# EasyEDA Pro project STM32F103C8T6_C6T6核心板.eprj, schematic Schematic3
Board Name: Board3; Create Date: 2025-06-21; Page Name: P3_MicroUSB; Project Name: F103C8T6TYPEC; Schematic Name: Schematic3; Update Date: 2025-06-21; Add into BOM: yes; Company: 嘉立创EDA; Convert to PCB: yes; Page Size: A4; Version: V1.0
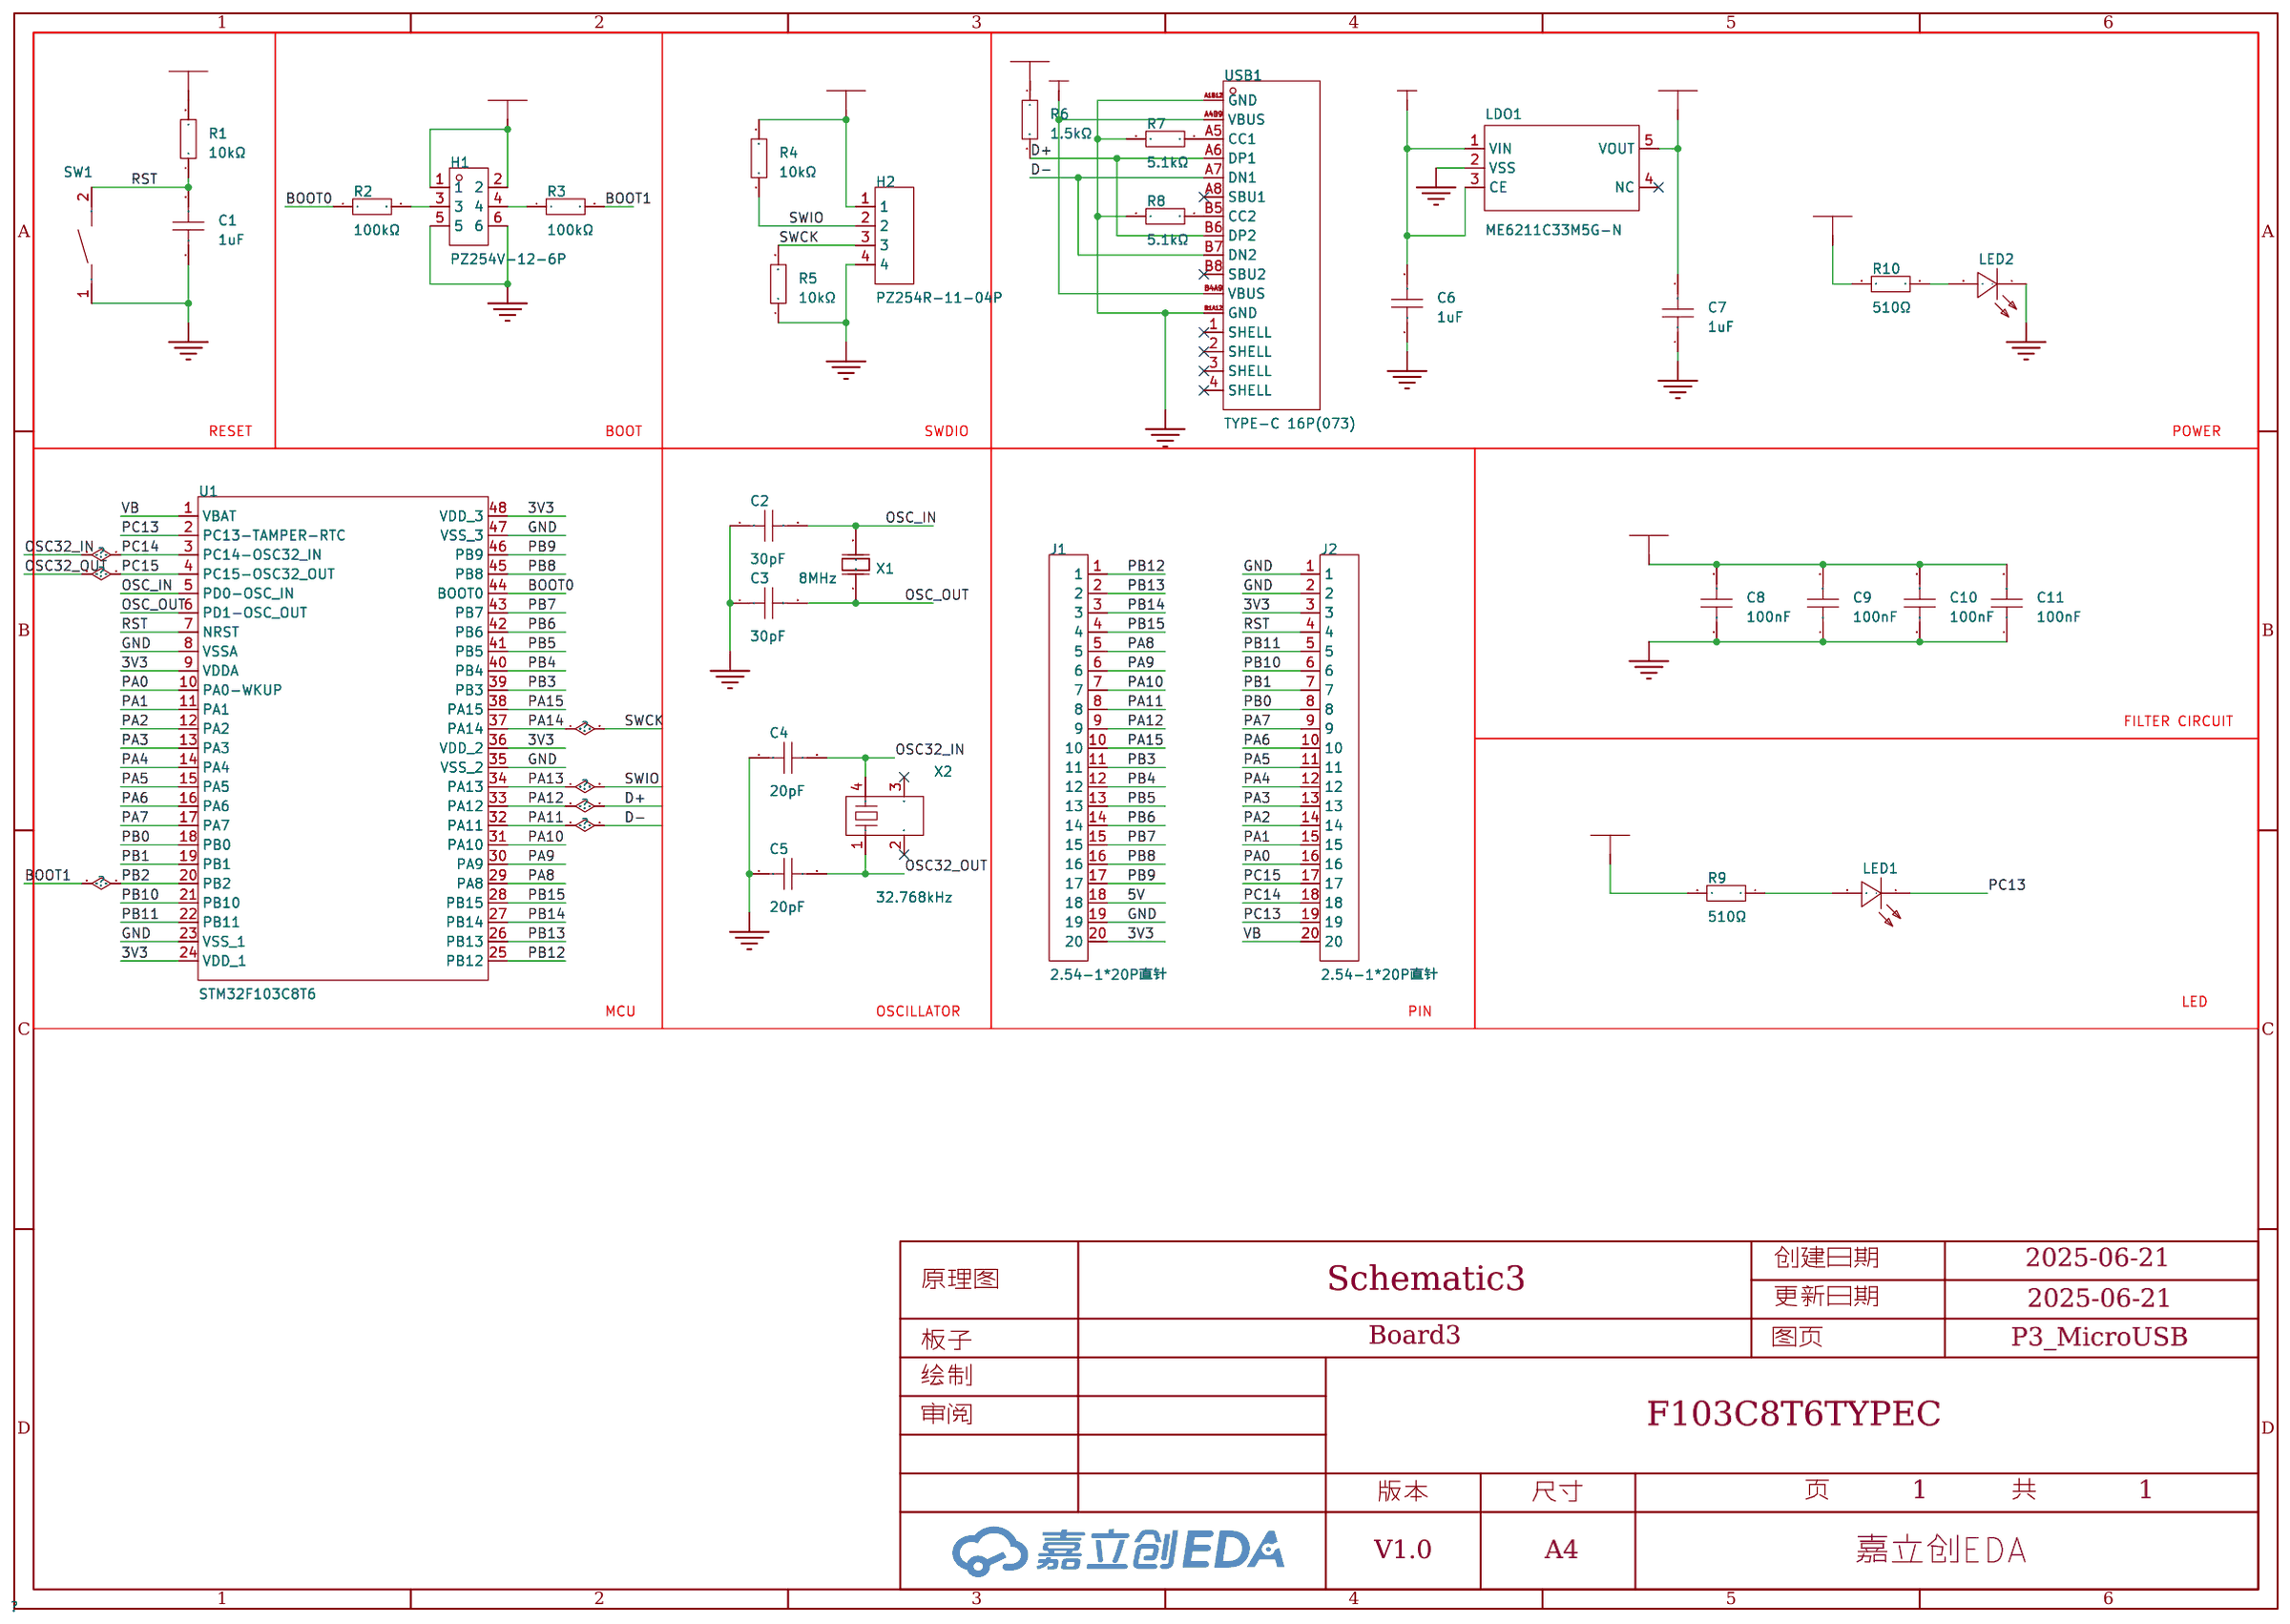
[diagram p2: schematic sheet]

## Parts
C1  1uF  [C0603]
C2  30pF  [C0603]
C3  30pF  [C0603]
C4  20pF  [C0603]
C5  20pF  [C0603]
C6  1uF  [C0603]
C7  1uF  [C0603]
C8  100nF  [C0603]
C9  100nF  [C0603]
C10  100nF  [C0603]
C11  100nF  [C0603]
H1  PZ254V-12-6P  [HDR-TH_6P-P2.54-V-M-R2-C3-S2.54]
H2  PZ254R-11-04P  [HDR-TH_4P-P2.54-H-M-W10.4]
J1  2.54-1*20P直针  [HDR-TH_20P-P2.54-V-M-1]
J2  2.54-1*20P直针  [HDR-TH_20P-P2.54-V-M-1]
LDO1  ME6211C33M5G-N  [SOT-23-5_L3.0-W1.7-P0.95-LS2.8-BL]
LED1  LTST-C190KSKT  [LED0603-RD]
LED2  LTST-C190KSKT  [LED0603-RD]
R1  10kΩ  [R0603]
R2  100kΩ  [R0603]
R3  100kΩ  [R0603]
R4  10kΩ  [R0603]
R5  10kΩ  [R0603]
R6  1.5kΩ  [R0603]
R7  5.1kΩ  [R0603]
R8  5.1kΩ  [R0603]
R9  510Ω  [R0603]
R10  510Ω  [R0603]
SW1  TS-1088-AR02016  [SW-SMD_L3.9-W3.0-P4.45]
U1  STM32F103C8T6  [LQFP-48_L7.0-W7.0-P0.50-LS9.0-BL]
USB1  TYPE-C 16P(073)  [USB-C-SMD_TYPE-C16PIN_C668624]
X1  8MHz  [HC-49US_L11.5-W4.5-P4.88]
X2  32.768kHz  [MC-306_4P-L8.0-W3.2-P5.5-BL]

## Library data of the parts
C1-C11 = CC0603KRX7R9BB105: LCSC Part Name: 1uF ±10% 50V; Supplier Part: C559769; Manufacturer: YAGEO(国巨); Supplier Footprint: 0603; JLCPCB Part Class: 扩展库; Datasheet: https://atta.szlcsc.com/upload/public/pdf/source/20181031/C325451_C7CF01155AE3010E0D610C52F5FE7D31.pdf; Supplier: LCSC; Tolerance: ±10%; Voltage Rated: 50V; Temperature Coefficient: X7R
H1 = PZ254V-12-6P: LCSC Part Name: 间距:2.54mm 2x3P 直插 方针; Supplier Part: C492420; Manufacturer: XFCN(兴飞); Supplier Footprint: 插件,P=2.54mm; JLCPCB Part Class: 扩展库; Datasheet: https://atta.szlcsc.com/upload/public/pdf/source/20200309/C492420_BAECB307B001054C09D200388220EAE6.pdf; Supplier: LCSC; Pin Structure: 2x3P; Pitch: 2.54mm; Row Spacing: 2.54mm; Circluar Pins/Square Pins: 方针; Mounting Type: 直插; Number of Rows: 双排; Number of Pins: 6P; Length of Mating Pin: 6mm; Insulation Height: 2.5mm; Length of End Connection Pin: 3mm; Contact Material: 黄铜; Operating Temperature Range: -40℃~+105℃; Color: 黑色
H2 = PZ254R-11-04P: LCSC Part Name: 1x4P 间距:2.54mm 方针 弯插; Supplier Part: C492412; Manufacturer: XFCN(兴飞); Supplier Footprint: 弯插,P=2.54mm; JLCPCB Part Class: 扩展库; Datasheet: https://atta.szlcsc.com/upload/public/pdf/source/20200309/C492412_B0EFFC1946AB079B8871416C4A09EF6C.pdf; Supplier: LCSC; Pin Structure: 1x4P; Pitch: 2.54mm; Circluar Pins/Square Pins: 方针; Mounting Type: 弯插; Number of Rows: 单排; Number of Pins: 4P; Length of Mating Pin: 6mm; Insulation Height: 2.5mm; Contact Material: 黄铜; Operating Temperature: -40℃~+105℃; Color: 黑色
J1 J2 = 2.54-1*20P直针: LCSC Part Name: 1x20P 间距:2.54mm 方针 直插; Supplier Part: C50981; Manufacturer: BOOMELE(博穆精密); Supplier Footprint: 插件,P=2.54mm; JLCPCB Part Class: 扩展库; Datasheet: https://atta.szlcsc.com/upload/public/pdf/source/20151109/1457707572883.pdf; Supplier: LCSC; Pin Structure: 1x20P; Pitch: 2.54mm; Circluar Pins/Square Pins: 方针; Mounting Type: 直插; Number of Rows: 单排; Number of Pins: 20P; Current Rating: 3A; Contact Material: 黄铜; Operating Temperature: -40℃~+105℃; Color: 黑色
LDO1 = ME6211C33M5G-N: LCSC Part Name: 输入6V 输出3.3V 500mA; Supplier Part: C82942; Manufacturer: MICRONE(南京微盟); Supplier Footprint: SOT-23-5; JLCPCB Part Class: 扩展库; Datasheet: https://atta.szlcsc.com/upload/public/pdf/source/20170918/C82942_1505727073070976520.pdf; Supplier: LCSC; Output Type: 固定; Voltage - Supply: 6V; Output Voltage: 3.3V; Output Current: 500mA; Power Supply Rejection Ratio (PSRR): 70dB@(1kHz)；62dB@(10kHz); Voltage Dropout: 260mV@(200mA); Features: 短路保护(SCP)；低ESR；过流保护(OCP)；带使能; Output Configuration: 正极; Number of Outputs: 1
LED1 LED2 = LTST-C190KSKT: LCSC Part Name: 黄灯; Supplier Part: C125095; Manufacturer: LITEON(光宝); Supplier Footprint: 0603; JLCPCB Part Class: 扩展库; Datasheet: https://atta.szlcsc.com/upload/public/pdf/source/20180129/C125095_15171881843821315881.pdf; Supplier: LCSC; Emitted Color: 黄色; Forward Voltage (VF): 2.1V; Power Dissipation: 75mW; Forward Current: 20mA; Dominant Wavelength: 584.5nm~597nm; Peak Wavelength: 588nm; Lens Color: 无色透明透镜; Luminous Intensity: 104mcd; Viewing Angle: 130°; Operating Temperature: -30℃~+85℃
R1-R10 = RC0603FR-0710KL: LCSC Part Name: 厚膜电阻 10kΩ ±1% 100mW; Supplier Part: C98220; Manufacturer: YAGEO(国巨); Supplier Footprint: 0603; JLCPCB Part Class: 扩展库; Datasheet: https://atta.szlcsc.com/upload/public/pdf/source/20180927/C295883_E8D83085EA81BD7DE0B2B681138C15EE.pdf; Supplier: LCSC; Type: 厚膜电阻; Tolerance: ±1%; Power(Watts): 100mW; Overload Voltage (Max): 75V; Temperature Coefficient: ±100ppm/℃; Operating Temperature Range: -55℃~+155℃
SW1 = TS-1088-AR02016: LCSC Part Name: 4*3*2mm 立贴 轻触开关; Supplier Part: C720477; Manufacturer: XUNPU(讯普); Supplier Footprint: SMD; JLCPCB Part Class: 基础库; Datasheet: https://atta.szlcsc.com/upload/public/pdf/source/20200810/C720475_60D09DD6C54279ADDB2DC25100F1CC11.pdf; Supplier: LCSC; Circuit: 单刀单掷; Actuator Style: 圆形按钮; Operating Force: 160gf; Mounting Style: 立贴; Switch Length: 4mm; Switch Width: 3mm; Switch Height: 2mm; Strike Gundam: 不带; Contact Current: 50mA; Voltage Rating (DC): 12V; Insulation Resistance: 100MΩ; Actuator/Cap Color: 黑色; Pin Style: SMD接片; Mechanical Life: 10万次; Operating Temperature: -30℃~+80℃
U1 = STM32F103C8T6: LCSC Part Name: 主流增强型ARM Cortex-M3 MCU，具有64 KB Flash、72 MHz CPU、电机控制、USB和CAN; Supplier Part: C8734; Manufacturer: ST(意法半导体); Supplier Footprint: LQFP-48(7x7); JLCPCB Part Class: 扩展库; Datasheet: https://atta.szlcsc.com/upload/public/pdf/source/20220812/8363ACEC51AD55ECEB84799464F7CB85.pdf; Supplier: LCSC; CPU Core: ARM-M3; CPU Maximum Speed: 72MHz; Program Storage Size: 64KB; Program Memory Type: FLASH; Number of I/O: 37; ADC (Bit): 12bit; Voltage - Supply: 2V~3.6V
USB1 = TYPE-C 16P(073): LCSC Part Name: Type-C 母 卧贴; Supplier Part: C668624; Manufacturer: SHOU HAN(首韩); Supplier Footprint: SMD; JLCPCB Part Class: 扩展库; Datasheet: https://atta.szlcsc.com/upload/public/pdf/source/20200618/C668624_CC51EC37614090AAD56C1421DE954C80.pdf; Supplier: LCSC; Connector Type: Type-C; Standard: USB 3.1; Gender: 母; Mounting Style: 卧贴; Number of Contacts: 16P; Number of Ports: 1; Current Rating - Power (Max): 5A; Operating Temperature Range: -25℃~+85℃; Rated Voltage (Max): 5V; Connect-Disconnect Life: 1万次; Core Colour: 黑色
X1 = X49SD8MSB2SI: LCSC Part Name: HC-49US 8MHZ 2P 49S 20PF ±10PPM -40~85℃（±30PPM); Supplier Part: C188205; Manufacturer: YXC(扬兴晶振); Supplier Footprint: HC-49S; JLCPCB Part Class: 扩展库; Datasheet: https://atta.szlcsc.com/upload/public/pdf/source/20240329/977D7F2434F98B2BE33270BB9FF3D86D.pdf; Supplier: LCSC; Type: 直插晶振; Normal temperature Frequency Tolerance: ±10ppm; Load Capacitance: 20pF; Frequency Stability: ±30ppm; Operating Temperature: -40℃~+85℃
X2 = Q13MC30610003: LCSC Part Name: 32.768kHz ±20ppm 12.5pF; Supplier Part: C16320; Manufacturer: EPSON(爱普生); Supplier Footprint: MC-306; JLCPCB Part Class: 扩展库; Datasheet: https://atta.szlcsc.com/upload/public/pdf/source/20161110/1478747315604.pdf; Supplier: LCSC; Type: 贴片晶振; Normal temperature Frequency Tolerance: ±20ppm; Load Capacitance: 12.5pF; Equivalent Series Resistance(ESR): 35kΩ; Operating Temperature: -40℃~+85℃

## Nets
3V3: C7.2 C8.2 C9.2 C10.2 C11.2 H1.1 H1.2 H2.1 J1.20 J2.3 LDO1.5(VOUT) R1.2 R4.2 R6.1 R9.2 R10.2 U1.9(VDDA) U1.24(VDD_1) U1.36(VDD_2) U1.48(VDD_3)
5V: C6.2 J1.18 LDO1.1(VIN) LDO1.3(CE) USB1.A4B9(VBUS) USB1.B4A9(VBUS)
GND: C1.1 C2.1 C3.1 C4.1 C5.1 C6.1 C7.1 C8.1 C9.1 C10.1 C11.1 H1.5 H1.6 H2.4 J1.19 J2.1 J2.2 LDO1.2(VSS) LED2.1(-) R5.1 R7.2 R8.2 SW1.1 U1.8(VSSA) U1.23(VSS_1) U1.35(VSS_2) U1.47(VSS_3) USB1.A1B12(GND) USB1.B1A12(GND)
BOOT0: R2.1 U1.44(BOOT0)
BOOT1: R3.2 U1.20(PB2)
D+: J1.9 R6.2 U1.33(PA12) USB1.A6(DP1) USB1.B6(DP2)
D-: J1.8 U1.32(PA11) USB1.A7(DN1) USB1.B7(DN2)
OSC32_IN: C4.2 J2.18 U1.3(PC14-OSC32_IN) X2.4
OSC32_OUT: C5.2 J2.17 U1.4(PC15-OSC32_OUT) X2.1
OSC_IN: C2.2 U1.5(PD0-OSC_IN) X1.2(OSC2)
OSC_OUT: C3.2 U1.6(PD1-OSC_OUT) X1.1(OSC1)
PA0: J2.16 U1.10(PA0-WKUP)
PA1: J2.15 U1.11(PA1)
PA2: J2.14 U1.12(PA2)
PA3: J2.13 U1.13(PA3)
PA4: J2.12 U1.14(PA4)
PA5: J2.11 U1.15(PA5)
PA6: J2.10 U1.16(PA6)
PA7: J2.9 U1.17(PA7)
PA8: J1.5 U1.29(PA8)
PA9: J1.6 U1.30(PA9)
PA10: J1.7 U1.31(PA10)
PA13: H2.2 R4.1 U1.34(PA13)
PA14: H2.3 R5.2 U1.37(PA14)
PA15: J1.10 U1.38(PA15)
PB0: J2.8 U1.18(PB0)
PB1: J2.7 U1.19(PB1)
PB3: J1.11 U1.39(PB3)
PB4: J1.12 U1.40(PB4)
PB5: J1.13 U1.41(PB5)
PB6: J1.14 U1.42(PB6)
PB7: J1.15 U1.43(PB7)
PB8: J1.16 U1.45(PB8)
PB9: J1.17 U1.46(PB9)
PB10: J2.6 U1.21(PB10)
PB11: J2.5 U1.22(PB11)
PB12: J1.1 U1.25(PB12)
PB13: J1.2 U1.26(PB13)
PB14: J1.3 U1.27(PB14)
PB15: J1.4 U1.28(PB15)
PC13: J2.19 LED1.1(-) U1.2(PC13-TAMPER-RTC)
RST: C1.2 J2.4 R1.1 SW1.2 U1.7(NRST)
VB: J2.20 U1.1(VBAT)
$1N4238: H1.3 R2.2
$1N4239: H1.4 R3.1
$1N4255: R8.1 USB1.B5(CC2)
$1N4256: R7.1 USB1.A5(CC1)
$1N4263: LED2.2(+) R10.1
$1N4468: LED1.2(+) R9.1

Not connected (* = marked no-connect by the designer): LDO1 4(NC)*; USB1 1(SHELL)* 2(SHELL)* 3(SHELL)* 4(SHELL)* A8(SBU1)* B8(SBU2)*; X2 2* 3*

## Notes on the sheet
- RESET
- BOOT
- SWDIO
- POWER
- FILTER CIRCUIT
- MCU
- OSCILLATOR
- PIN
- LED
